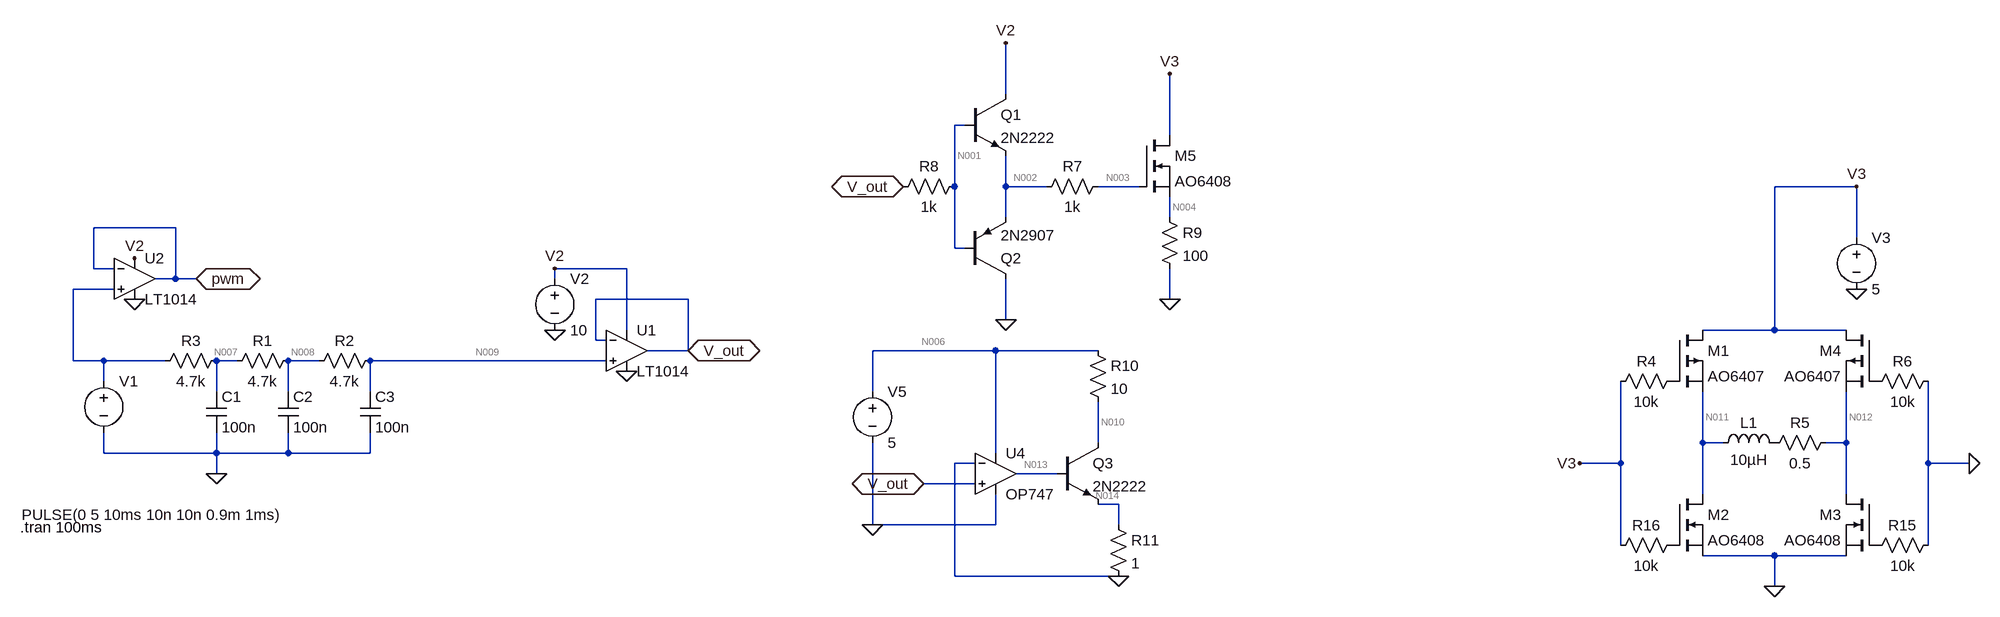
[diagram p0: schematic H_bridge_experimentation.asc]
H_bridge_experimentation.asc, the LTspice schematic file:
Version 4
SHEET 1 3028 1252
WIRE 1440 -160 1440 -240
WIRE 1376 -112 1360 -112
WIRE 1696 -96 1696 -192
WIRE 1360 -16 1360 -112
WIRE 1440 -16 1440 -64
WIRE 1504 -16 1440 -16
WIRE 1648 -16 1584 -16
WIRE 2768 -16 2640 -16
WIRE 1440 32 1440 -16
WIRE 1696 32 1696 0
WIRE 144 48 16 48
WIRE 2768 64 2768 -16
WIRE 1360 80 1360 -16
WIRE 1376 80 1360 80
WIRE 16 112 16 48
WIRE 48 112 16 112
WIRE 848 112 736 112
WIRE 144 128 144 48
WIRE 144 128 112 128
WIRE 176 128 144 128
WIRE 736 128 736 112
WIRE 48 144 -16 144
WIRE 944 160 800 160
WIRE 1696 160 1696 112
WIRE 1440 192 1440 128
WIRE 848 208 848 112
WIRE 2640 208 2640 -16
WIRE 2640 208 2528 208
WIRE 2752 208 2640 208
WIRE 800 224 800 160
WIRE 816 224 800 224
WIRE 944 240 944 160
WIRE 944 240 880 240
WIRE 1424 240 1232 240
WIRE 1584 240 1424 240
WIRE -16 256 -16 144
WIRE 32 256 -16 256
WIRE 128 256 32 256
WIRE 240 256 208 256
WIRE 368 256 320 256
WIRE 816 256 448 256
WIRE 32 288 32 256
WIRE 208 304 208 256
WIRE 320 304 320 256
WIRE 448 304 448 256
WIRE 1232 304 1232 240
WIRE 1584 384 1584 320
WIRE 2528 384 2528 304
WIRE 2560 384 2528 384
WIRE 2752 384 2752 304
WIRE 2752 384 2720 384
WIRE 32 400 32 368
WIRE 208 400 208 368
WIRE 208 400 32 400
WIRE 320 400 320 368
WIRE 320 400 208 400
WIRE 448 400 448 368
WIRE 448 400 320 400
WIRE 1424 400 1424 240
WIRE 1392 416 1360 416
WIRE 2400 416 2400 288
WIRE 2400 416 2336 416
WIRE 2880 416 2880 288
WIRE 2944 416 2880 416
WIRE 208 432 208 400
WIRE 1520 432 1456 432
WIRE 1392 448 1312 448
WIRE 2528 464 2528 384
WIRE 2752 464 2752 384
WIRE 1616 480 1584 480
WIRE 1232 512 1232 384
WIRE 1424 512 1424 464
WIRE 1424 512 1232 512
WIRE 1616 512 1616 480
WIRE 2400 544 2400 416
WIRE 2880 544 2880 416
WIRE 2640 560 2528 560
WIRE 2752 560 2640 560
WIRE 1360 592 1360 416
WIRE 1616 592 1360 592
WIRE 2640 608 2640 560
FLAG 208 432 0
FLAG 736 208 0
FLAG 848 272 0
FLAG 2768 144 0
FLAG 2640 608 0
FLAG 176 128 pwm
IOPIN 176 128 BiDir
FLAG 80 160 0
FLAG 736 112 V2
FLAG 80 96 V2
FLAG 944 240 V_out
IOPIN 944 240 BiDir
FLAG 2768 -16 V3
FLAG 1440 -240 V2
FLAG 1440 192 0
FLAG 1696 160 0
FLAG 1696 -192 V3
FLAG 1280 -16 V_out
IOPIN 1280 -16 BiDir
FLAG 2336 416 V3
FLAG 2944 416 0
FLAG 1312 448 V_out
IOPIN 1312 448 BiDir
FLAG 1232 512 0
FLAG 1616 592 0
SYMBOL res 224 240 R90
WINDOW 0 0 56 VBottom 2
WINDOW 3 32 56 VTop 2
SYMATTR InstName R3
SYMATTR Value 4.7k
SYMBOL voltage 32 272 R0
WINDOW 3 -128 224 Left 2
WINDOW 123 0 0 Left 0
WINDOW 39 0 0 Left 0
SYMATTR InstName V1
SYMATTR Value PULSE(0 5 10ms 10n 10n 0.9m 1ms)
SYMBOL cap 192 304 R0
SYMATTR InstName C1
SYMATTR Value 100n
SYMBOL res 336 240 R90
WINDOW 0 0 56 VBottom 2
WINDOW 3 32 56 VTop 2
SYMATTR InstName R1
SYMATTR Value 4.7k
SYMBOL cap 304 304 R0
SYMATTR InstName C2
SYMATTR Value 100n
SYMBOL res 464 240 R90
WINDOW 0 0 56 VBottom 2
WINDOW 3 32 56 VTop 2
SYMATTR InstName R2
SYMATTR Value 4.7k
SYMBOL cap 432 304 R0
SYMATTR InstName C3
SYMATTR Value 100n
SYMBOL voltage 736 112 R0
WINDOW 123 0 0 Left 0
WINDOW 39 0 0 Left 0
SYMATTR InstName V2
SYMATTR Value 10
SYMBOL OpAmps\\LT1014 848 176 R0
SYMATTR InstName U1
SYMBOL pmos 2480 208 R0
SYMATTR InstName M1
SYMATTR Value AO6407
SYMBOL ind 2544 400 R270
WINDOW 0 32 56 VTop 2
WINDOW 3 5 56 VBottom 2
SYMATTR InstName L1
SYMATTR Value 10µH
SYMBOL res 2736 368 R90
WINDOW 0 0 56 VBottom 2
WINDOW 3 32 56 VTop 2
SYMATTR InstName R5
SYMATTR Value 0.5
SYMBOL nmos 2480 464 R0
SYMATTR InstName M2
SYMATTR Value AO6408
SYMBOL voltage 2768 48 R0
WINDOW 123 0 0 Left 0
WINDOW 39 0 0 Left 0
SYMATTR InstName V3
SYMATTR Value 5
SYMBOL OpAmps\\LT1014 80 64 R0
SYMATTR InstName U2
SYMBOL nmos 2800 464 M0
SYMATTR InstName M3
SYMATTR Value AO6408
SYMBOL pmos 2800 208 M0
SYMATTR InstName M4
SYMATTR Value AO6407
SYMBOL npn 1376 -160 R0
SYMATTR InstName Q1
SYMATTR Value 2N2222
SYMBOL pnp 1376 128 M180
SYMATTR InstName Q2
SYMATTR Value 2N2907
SYMBOL res 1600 -32 R90
WINDOW 0 0 56 VBottom 2
WINDOW 3 32 56 VTop 2
SYMATTR InstName R7
SYMATTR Value 1k
SYMBOL nmos 1648 -96 R0
SYMATTR InstName M5
SYMATTR Value AO6408
SYMBOL res 1376 -32 R90
WINDOW 0 0 56 VBottom 2
WINDOW 3 32 56 VTop 2
SYMATTR InstName R8
SYMATTR Value 1k
SYMBOL res 1680 16 R0
SYMATTR InstName R9
SYMATTR Value 100
SYMBOL res 2496 272 R90
WINDOW 0 0 56 VBottom 2
WINDOW 3 32 56 VTop 2
SYMATTR InstName R4
SYMATTR Value 10k
SYMBOL res 2896 272 R90
WINDOW 0 0 56 VBottom 2
WINDOW 3 32 56 VTop 2
SYMATTR InstName R6
SYMATTR Value 10k
SYMBOL res 2896 528 R90
WINDOW 0 0 56 VBottom 2
WINDOW 3 32 56 VTop 2
SYMATTR InstName R15
SYMATTR Value 10k
SYMBOL res 2496 528 R90
WINDOW 0 0 56 VBottom 2
WINDOW 3 32 56 VTop 2
SYMATTR InstName R16
SYMATTR Value 10k
SYMBOL voltage 1232 288 R0
WINDOW 123 0 0 Left 0
WINDOW 39 0 0 Left 0
SYMATTR InstName V5
SYMATTR Value 5
SYMBOL OpAmps\\OP747 1424 368 R0
SYMATTR InstName U4
SYMBOL res 1568 224 R0
SYMATTR InstName R10
SYMATTR Value 10
SYMBOL npn 1520 384 R0
SYMATTR InstName Q3
SYMATTR Value 2N2222
SYMBOL res 1600 496 R0
SYMATTR InstName R11
SYMATTR Value 1
TEXT -98 516 Left 2 !.tran 100ms

The netlist it stands for:
* H_bridge_experimentation.asc
R3 N007 N005 4.7k
V1 N005 0 PULSE(0 5 10ms 10n 10n 0.9m 1ms)
C1 N007 0 100n
R1 N008 N007 4.7k
C2 N008 0 100n
R2 N009 N008 4.7k
C3 N009 0 100n
V2 V2 0 10
XU1 N009 V_out V2 0 V_out LT1014  ; pins In+ In- V+ V- OUT
M1 V3 P001 N011 N011 AO6407
L1 N011 P002 10µH
R5 N012 P002 0.5
M2 N011 P003 0 0 AO6408
V3 V3 0 5
XU2 N005 pwm V2 0 pwm LT1014  ; pins In+ In- V+ V- OUT
M3 N012 P004 0 0 AO6408
M4 V3 P005 N012 N012 AO6407
Q1 V2 N001 N002 0 2N2222
Q2 0 N001 N002 0 2N2907
R7 N003 N002 1k
M5 V3 N003 N004 N004 AO6408
R8 N001 V_out 1k
R9 N004 0 100
R4 P001 V3 10k
R6 0 P005 10k
R15 0 P004 10k
R16 P003 V3 10k
V5 N006 0 5
XU4 V_out 0 N006 0 N013 OP747  ; pins In+ In- V+ V- OUT
R10 N006 N010 10
Q3 N010 N013 N014 0 2N2222
R11 N014 0 1
.model NPN NPN
.model PNP PNP
.lib standard.bjt
.model NMOS NMOS
.model PMOS PMOS
.lib standard.mos
.tran 100ms
.backanno
.end

* Results of the author's LTspice run, read from the files saved beside the schematic
* Operating Point, zero values left out:
*   V(n007) = 59.11 µV
*   V(n008) = 118.2 µV
*   V(n009) = 177.3 µV
*   V(v2) = 10 V
*   V(v_out) = 33.44 mV
*   V(v3) = 5 V
*   V(p001) = 5 V
*   V(n011) = 1.786 V
*   V(p002) = 1.792 V
*   V(n012) = 4.809 V
*   V(p003) = 5 V
*   V(pwm) = 33.37 mV
*   V(n001) = 33.44 mV
*   V(n002) = 34.75 mV
*   V(n003) = 34.75 mV
*   V(n004) = 190.4 nV
*   V(n006) = 5 V
*   V(n013) = 1.559 V
*   V(n010) = 747.9 mV
*   V(n014) = 444.1 mV
*   Ic(Q3) = 425.2 mA
*   Ib(Q3) = 18.86 mA
*   Ie(Q3) = -444.1 mA
*   Ic(Q1) = 9.983 pA
*   Ib(Q1) = -9.971 pA
*   Id(M5) = 1.899 nA
*   Is(M5) = -1.899 nA
*   Id(M3) = 968.2 pA
*   Is(M3) = -968.2 pA
*   Id(M2) = 150.4 A
*   Is(M2) = -150.4 A
*   Id(M4) = 6.033 A
*   Is(M4) = -6.033 A
*   Id(M1) = 144.4 A
*   Is(M1) = -144.4 A
*   I(L1) = -6.033 A
*   I(R11) = 444.1 mA
*   I(R10) = 425.2 mA
*   I(R9) = 1.904 nA
*   I(R8) = 9.937 pA
*   I(R5) = 6.033 A
*   I(R2) = 12.58 nA
*   I(R1) = 12.58 nA
*   I(R3) = 12.58 nA
*   I(V5) = -444.1 mA
*   I(V3) = -150.4 A
*   I(V2) = -472.9 µA
*   I(V1) = 25.15 nA
*   Ix(u1:1) = -12.58 nA
*   Ix(u1:2) = -12.42 nA
*   Ix(u1:3) = 236.6 µA
*   Ix(u1:4) = -231.7 µA
*   Ix(u1:5) = 18.18 nA
*   Ix(u2:1) = -12.58 nA
*   Ix(u2:2) = -12.42 nA
*   Ix(u2:3) = 236.3 µA
*   Ix(u2:4) = -231.4 µA
*   Ix(u2:5) = 12.43 nA
*   Ix(u4:1) = -5.734 nA
*   Ix(u4:2) = -18.15 nA
*   Ix(u4:99) = 18.92 mA
*   Ix(u4:50) = -62.98 µA
*   Ix(u4:45) = -18.86 mA
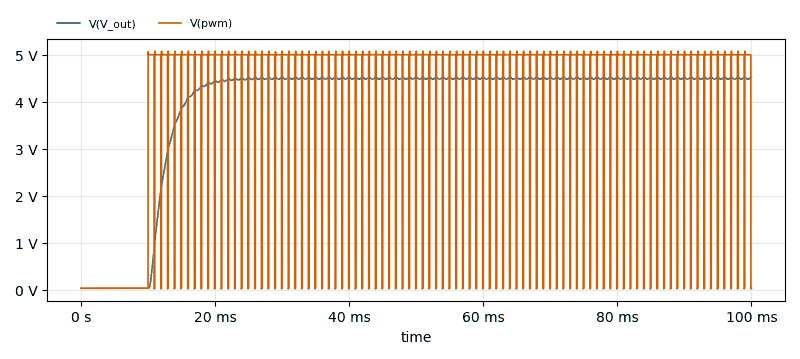
[diagram p1: Transient Analysis of H_bridge_experimentation.asc, plotted from the saved traces]
* Transient Analysis, 1 run:
*   V(V_out): min 33.44 mV, max 4.528 V, average 3.929 V, rms 4.174 V, last 4.528 V
*   V(pwm): min 21.11 mV, max 5.074 V, average 4.056 V, rms 4.492 V, last 33.37 mV